# EAGLE design Magnetic Direction Sensor (EAGLE 9.5.2)
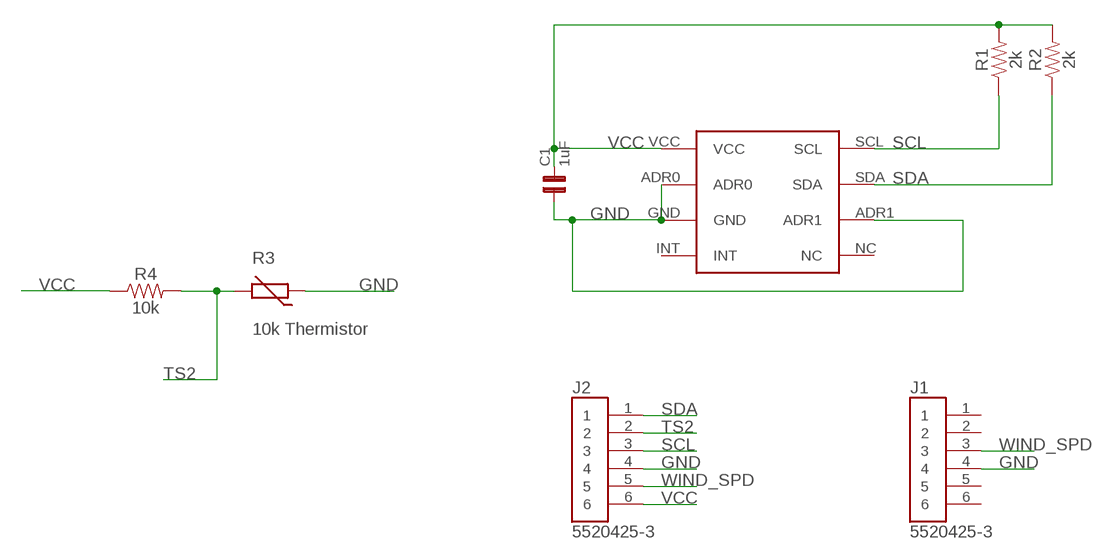
[diagram p0: schematic, sheet 1]

## Parts
C1  1uF  C0805  [0805]
J1  5520425-3  [TE_5520425-3]
J2  5520425-3  [TE_5520425-3]
R1  2k  RESISTOR0805  [0805]
R2  2k  RESISTOR0805  [0805]
R3  10k Thermistor  THERMISTOR-5  [R-5]
R4  10k  RESISTOR0805  [0805]
U$1  ALS31313  [ALS31313-500]

## Nets
GND: C1.1 J1.4 J2.4 R3.1 U$1.ADR0 U$1.ADR1 U$1.GND
SCL: J2.3 R1.1 U$1.SCL
SDA: J2.1 R2.1 U$1.SDA
TS2: J2.2 R3.2 R4.2
VCC: C1.2 J2.6 R1.2 R2.2 R4.1 U$1.VCC
WIND_SPD: J1.3 J2.5
Unconnected: J1.1 J1.2 J1.5 J1.6 U$1.INT U$1.NC

## Library data of the parts
C1 = capsmd:C0805
J1 J2 = main_board:5520425-3: CONN MOD JACK 6P6C VERT UNSHLD; CENTERLINE_PITCH: 1.02 mm[.04 in]; COMMENT: 5520425-3; DESCRIPTION: Conn RJ-25 F 6 POS 2.54mm Solder ST Thru-Hole 6 Terminal 1 Port Cat 3 Box/Package/Tray; DIGI-KEY_PART_NUMBER: A31415-ND; DIGI-KEY_PURCHASE_URL: https://www.digikey.com/product-detail/en/te-connectivity-amp-connectors/5520425-3/A31415-ND/769559?utm_source=snapeda&utm_medium=aggregator&utm_campaign=symbol; EU_ROHS_COMPLIANCE: Compliant; MF: TE Connectivity; MP: 5520425-3; NUMBER_OF_POSITIONS: 6; PACKAGE: None; TE_PURCHASE_URL: https://www.te.com/usa-en/product-5520425-3.html?te_bu=Cor&te_type=disp&te_campaign=seda_glo_cor-seda-global-disp-prtnr-fy19-seda-model-bom-cta_sma-317_1&elqCampaignId=32493
R1 R2 R4 = SparkFun-Resistors:RESISTOR: Generic Resistor Package
R3 = varistor:THERMISTOR: THERMISTOR
U$1 = main_board:ALS31313

## Board
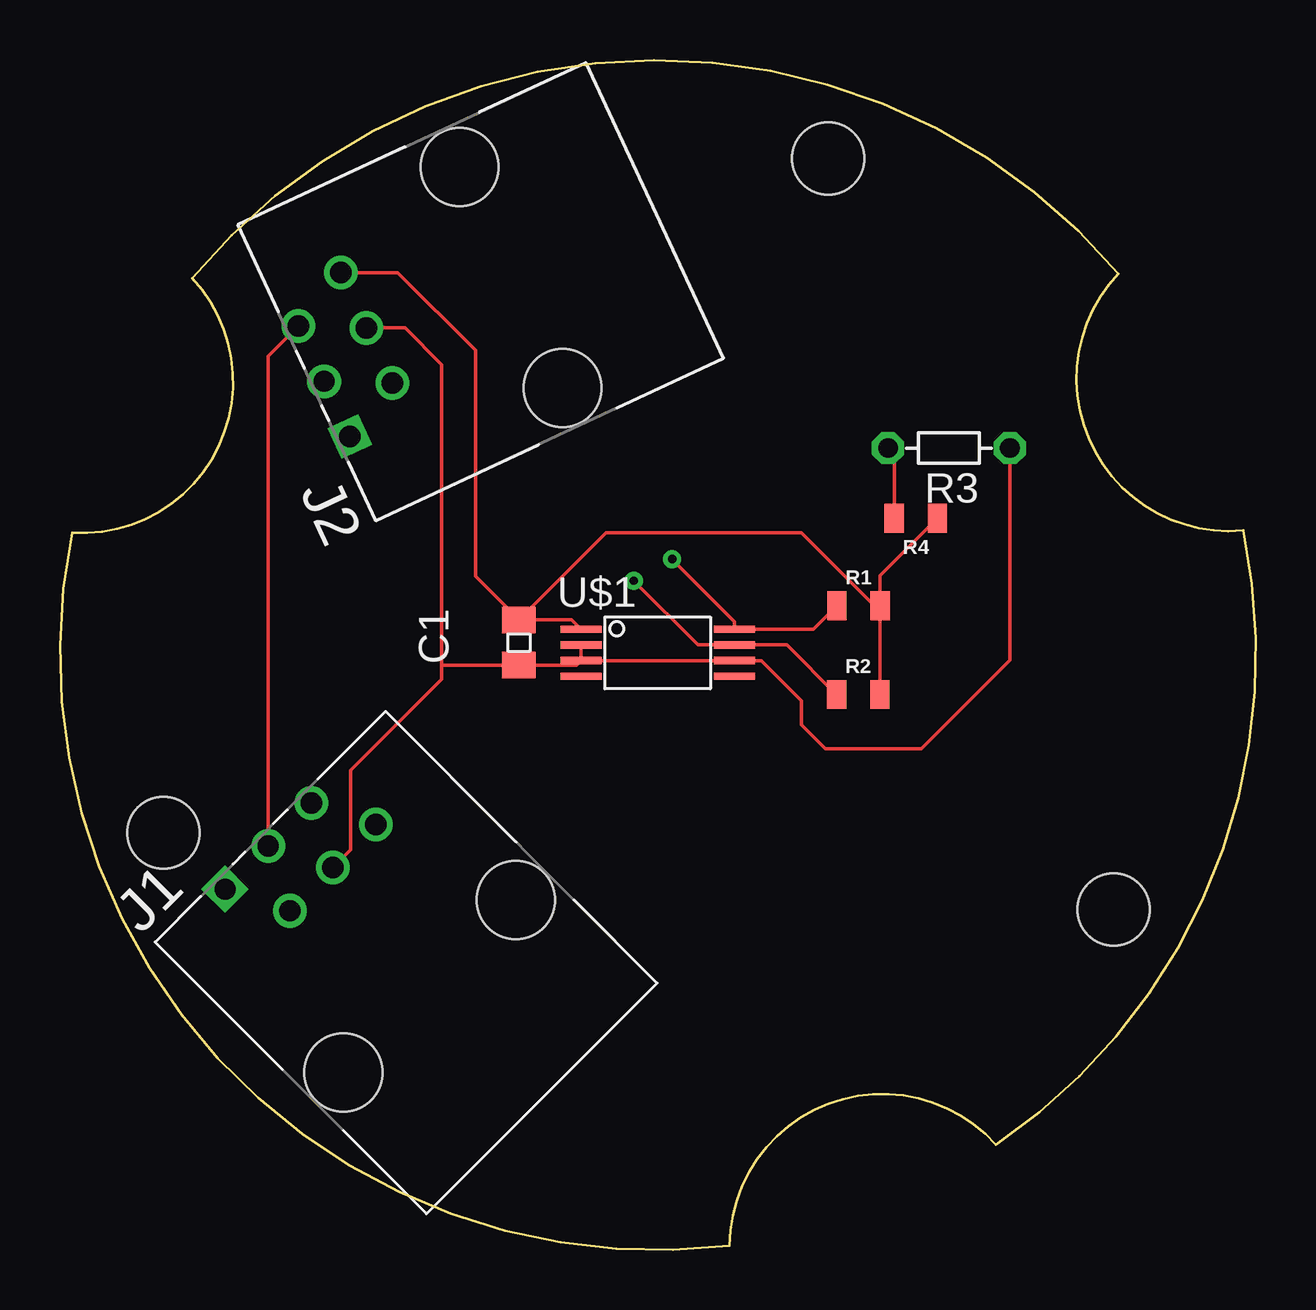
[diagram p1: board, top side]
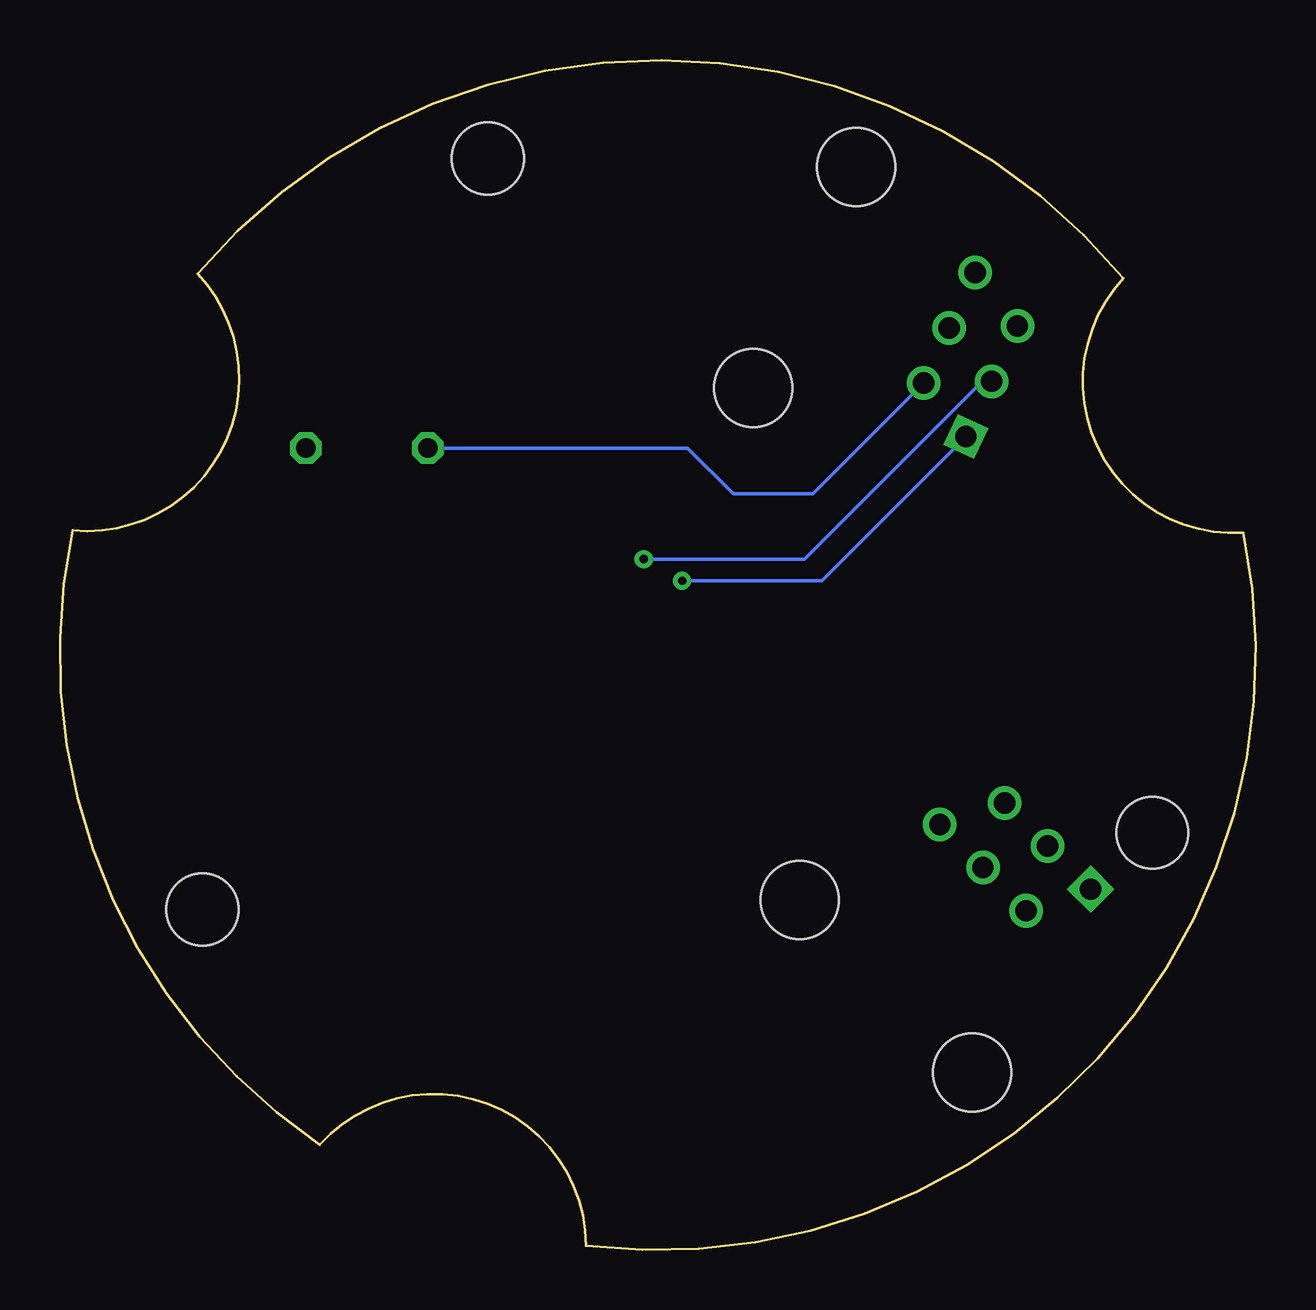
[diagram p2: board, bottom side, seen from below]

Size 49.84 x 49.58 mm. Coordinates in mm from the lower left corner, seen from the top.
Outline: 5.51,40.48 arc-100 44.11,40.68 arc139 49.31,29.98 arc-68 39.01,4.38 arc138 27.91,0.18 arc-109 0.51,29.88 arc137 5.51,40.48
Copper layers (1*16): Top 0.035mm / dielectric 1.5mm / Bottom 0.035mm
Design rules "default": minimum track width 6mil, minimum drill 0.35mm, track to track 6mil, track to pad 6mil, pad to pad 6mil, via to via 6mil, smd to smd 6mil, copper to edge 40mil, drill to drill 6mil, minimum pad ring 10mil, minimum via ring 8mil, stop-mask expansion 4mil, vias tented up to drill 0mil, thermal gap 10mil
Holes 3 mm at 4.31,17.38 32.01,45.48 43.91,14.18

### Footprints (pad centres in the part's own frame; a part is rotated, then mirrored left to right if it is on the bottom)
0805 = smd 1.092 x 1.397: 1 -0.94,0; 2 0.94,0
TE_5520425-3 = drill 0.89 square: 1 0,0 | drill 0.89: 2 1.27,-2.54; 3 2.54,0; 4 3.81,-2.54; 5 5.08,0; 6 6.35,-2.54 | hole 3.25: -1.91,-8.89; 8.25,-8.89
0805' = smd 0.8 x 1.2: 1 -0.9,0; 2 0.9,0
R-5 = drill 0.813 octagon: 1 -2.54,0; 2 2.54,0
ALS31313-500 = smd 1.7 x 0.3: ADR0 -3.2,0.325; ADR1 3.2,-0.325; GND -3.2,-0.325; INT -3.2,-0.975; NC 3.2,-0.975; SCL 3.2,0.975; SDA 3.2,0.325; VCC -3.2,0.975

### Placement (x,y rotation side)
C1  19.13,25.31 90 top
J1  6.88,15.03 45 top
J2  12.08,33.89 115 top
R1  2k  [0805']  33.28,26.84 0 top
R2  2k  [0805']  33.27,23.14 0 top
R3  37.05,33.41 180 top
R4  10k  [0805']  35.67,30.49 180 top
U$1  24.91,24.88 0 top

### Tracks (layer width: path | path; a pad name or v marks a point on that pad's centre or on a via)
GND
  Top 0.152: U$1.GND U$1.ADR1 29.24,24.55 30.91,22.88 30.91,21.88 31.91,20.88 35.91,20.88 39.59,24.56 R3.1 | U$1.ADR0 U$1.GND | U$1.GND 21.53,24.37 C1.1 15.92,24.37 15.91,24.38 | J2.4 14.38,38.42 15.91,36.88 15.91,24.38 | 15.91,24.38 15.91,23.78 12.11,19.98 12.11,16.67 J1.4
SCL  (via drill 0.35)
  Top 0.152: R1.1 31.4,25.85 U$1.SCL 28.11,26.18 v25.51,28.78
  Bottom 0.152: v25.51,28.78 18.81,28.78 11.4,36.19 J2.3
SDA  (via drill 0.35)
  Top 0.152: R2.1 30.31,25.2 U$1.SDA 26.59,25.2 v23.91,27.88
  Bottom 0.152: J2.1 18.09,27.88 v23.91,27.88
TS2
  Top 0.152: R4.2 34.77,33.15 R3.2
  Bottom 0.152: R3.2 23.68,33.41 21.77,31.5 18.46,31.5 J2.2
VCC
  Top 0.152: C1.2 21.32,26.25 U$1.VCC | R1.2 R2.2 | C1.2 17.31,28.07 17.31,37.48 14.07,40.72 J2.6 | R1.2 33.95,26.84 30.91,29.88 22.76,29.88 C1.2 | R4.1 34.18,28.1 R1.2
WIND_SPD
  Top 0.152: J1.3 8.68,37.24 J2.5